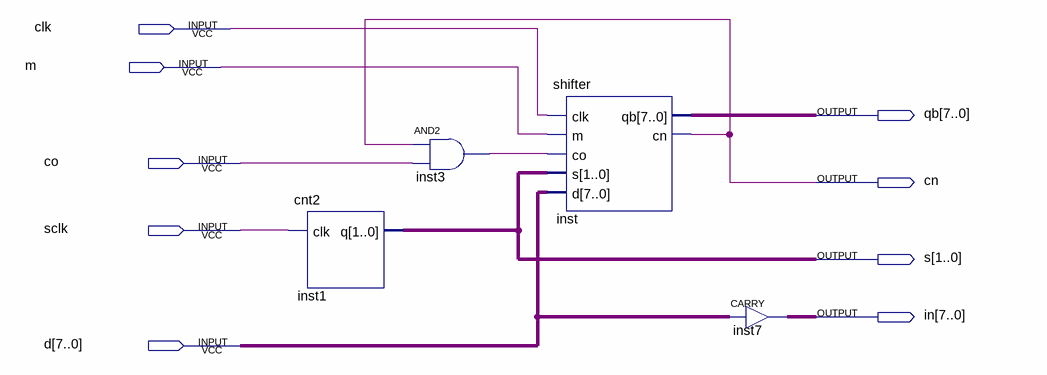
[diagram p0: schematic sheet]
// Quartus schematic top.bdf as structural Verilog: 4 symbols, 9 pins
module top (
  input  clk,
  input  m,
  input  co,
  input  sclk,
  input  [7:0] d,
  output [7:0] qb,
  output cn,
  output [1:0] s,
  output [7:0] in
);

  wire inst3_out;

  cnt2 inst1 (.clk(sclk), .q(s));
  and inst3 (inst3_out, cn, co);
  shifter inst (.clk(clk), .m(m), .co(inst3_out), .s(s), .d(d), .qb(qb), .cn(cn));
  CARRY inst7[7:0] (.IN(d), .OUT(in));
endmodule
